# EAGLE design platine_gesamt_V05 (EAGLE 6.4)
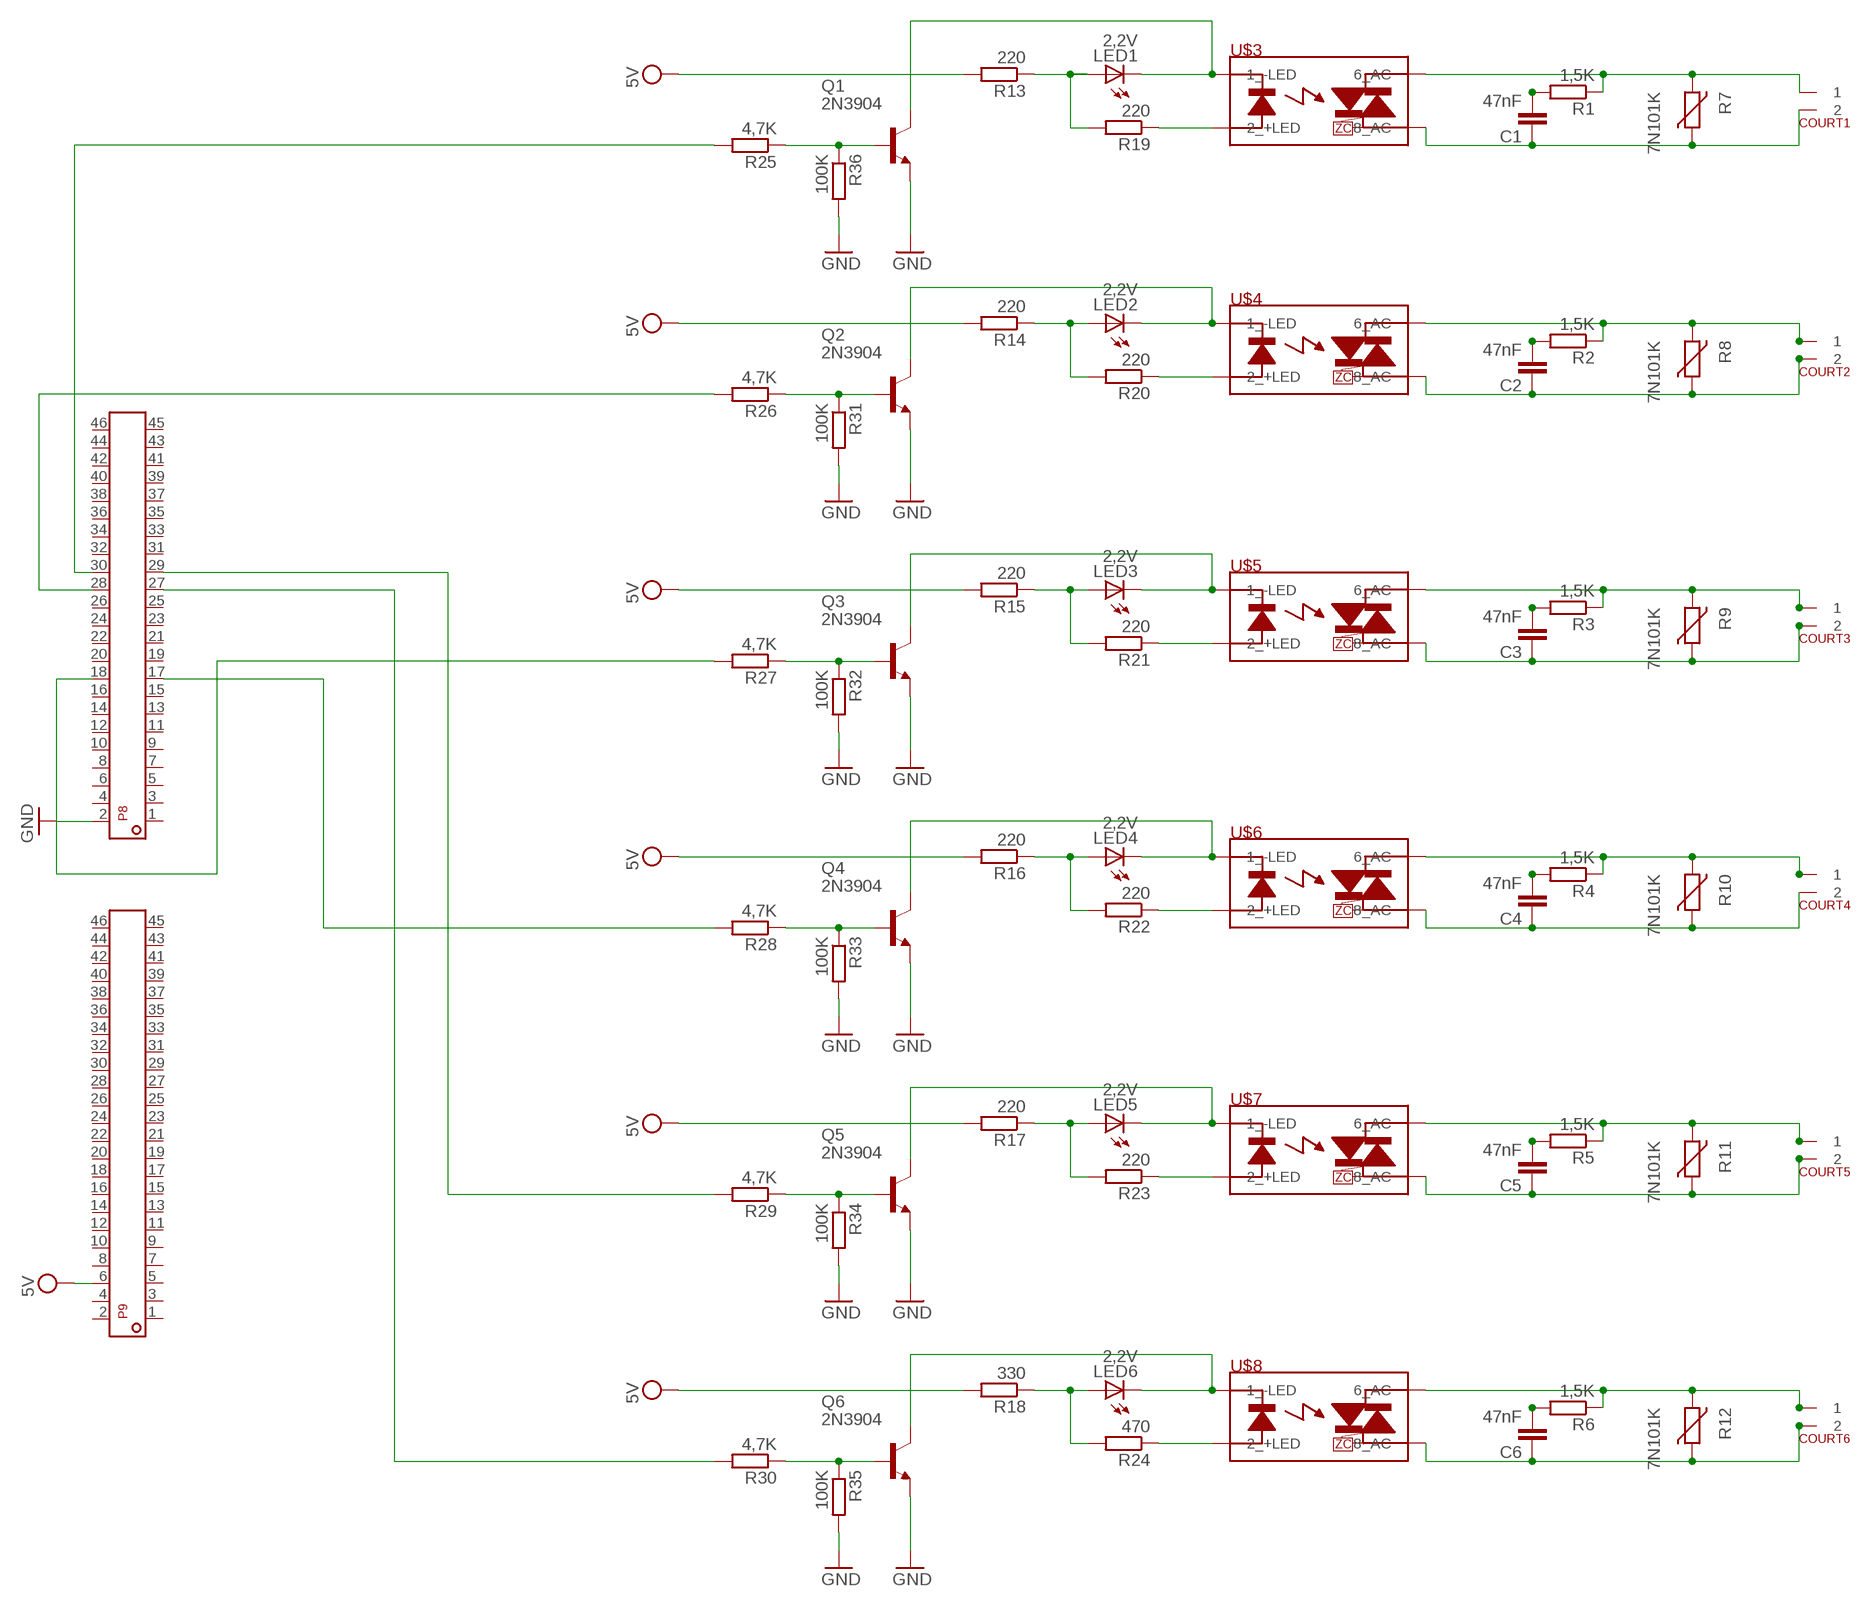
[diagram p0: schematic, sheet 1]

## Parts
C1  47nF  C7.5/3  [C7.5B3]
C2  47nF  C7.5/3  [C7.5B3]
C3  47nF  C7.5/3  [C7.5B3]
C4  47nF  C7.5/3  [C7.5B3]
C5  47nF  C7.5/3  [C7.5B3]
C6  47nF  C7.5/3  [C7.5B3]
COURT1  KLEMMENBLOCK_2POL  [KLEMMENBLOCK_2POL]
COURT2  KLEMMENBLOCK_2POL  [KLEMMENBLOCK_2POL]
COURT3  KLEMMENBLOCK_2POL  [KLEMMENBLOCK_2POL]
COURT4  KLEMMENBLOCK_2POL  [KLEMMENBLOCK_2POL]
COURT5  KLEMMENBLOCK_2POL  [KLEMMENBLOCK_2POL]
COURT6  KLEMMENBLOCK_2POL  [KLEMMENBLOCK_2POL]
LED1  2,2V  LED5MM  [LED5MM]
LED2  2,2V  LED5MM  [LED5MM]
LED3  2,2V  LED5MM  [LED5MM]
LED4  2,2V  LED5MM  [LED5MM]
LED5  2,2V  LED5MM  [LED5MM]
LED6  2,2V  LED5MM  [LED5MM]
P8  FEMALE_HEADER_2X23  [FE23-2W]
P9  FEMALE_HEADER_2X23  [FE23-2W]
Q1  2N3904  [TO92]
Q2  2N3904  [TO92]
Q3  2N3904  [TO92]
Q4  2N3904  [TO92]
Q5  2N3904  [TO92]
Q6  2N3904  [TO92]
R1  1,5K  R-EU_0204/7  [0204/7]
R2  1,5K  R-EU_0204/7  [0204/7]
R3  1,5K  R-EU_0204/7  [0204/7]
R4  1,5K  R-EU_0204/7  [0204/7]
R5  1,5K  R-EU_0204/7  [0204/7]
R6  1,5K  R-EU_0204/7  [0204/7]
R7  7N101K  VARISTOR-5  [R-5]
R8  7N101K  VARISTOR-5  [R-5]
R9  7N101K  VARISTOR-5  [R-5]
R10  7N101K  VARISTOR-5  [R-5]
R11  7N101K  VARISTOR-5  [R-5]
R12  7N101K  VARISTOR-5  [R-5]
R13  220  R-EU_0204/7  [0204/7]
R14  220  R-EU_0204/7  [0204/7]
R15  220  R-EU_0204/7  [0204/7]
R16  220  R-EU_0204/7  [0204/7]
R17  220  R-EU_0204/7  [0204/7]
R18  330  R-EU_0204/7  [0204/7]
R19  220  R-EU_0204/7  [0204/7]
R20  220  R-EU_0204/7  [0204/7]
R21  220  R-EU_0204/7  [0204/7]
R22  220  R-EU_0204/7  [0204/7]
R23  220  R-EU_0204/7  [0204/7]
R24  470  R-EU_0204/7  [0204/7]
R25  4,7K  R-EU_0204/7  [0204/7]
R26  4,7K  R-EU_0204/7  [0204/7]
R27  4,7K  R-EU_0204/7  [0204/7]
R28  4,7K  R-EU_0204/7  [0204/7]
R29  4,7K  R-EU_0204/7  [0204/7]
R30  4,7K  R-EU_0204/7  [0204/7]
R31  100K  R-EU_0204/7  [0204/7]
R32  100K  R-EU_0204/7  [0204/7]
R33  100K  R-EU_0204/7  [0204/7]
R34  100K  R-EU_0204/7  [0204/7]
R35  100K  R-EU_0204/7  [0204/7]
R36  100K  R-EU_0204/7  [0204/7]
U$3  IXYS_PS1201_SSRSIP4/8  [S202S02]
U$4  IXYS_PS1201_SSRSIP4/8  [S202S02]
U$5  IXYS_PS1201_SSRSIP4/8  [S202S02]
U$6  IXYS_PS1201_SSRSIP4/8  [S202S02]
U$7  IXYS_PS1201_SSRSIP4/8  [S202S02]
U$8  IXYS_PS1201_SSRSIP4/8  [S202S02]

## Nets
GND: P8.2 Q1.3(E) Q2.3(E) Q3.3(E) Q4.3(E) Q5.3(E) Q6.3(E) R31.2 R32.2 R33.2 R34.2 R35.2 R36.2
N$1: C1.2 R1.2
N$2: C2.2 R2.2
N$3: C3.2 R3.2
N$4: C4.2 R4.2
N$5: C5.2 R5.2
N$6: C6.2 R6.2
N$7: COURT1.1 R1.1 R7.2 U$3.6(6_AC)
N$8: P8.18 R27.2
N$9: C2.1 COURT2.2 R8.1 U$4.8(8_AC)
N$10: C3.1 COURT3.2 R9.1 U$5.8(8_AC)
N$11: C4.1 COURT4.2 R10.1 U$6.8(8_AC)
N$12: C5.1 COURT5.2 R11.1 U$7.8(8_AC)
N$13: C6.1 COURT6.2 R12.1 U$8.8(8_AC)
N$14: COURT2.1 R2.1 R8.2 U$4.6(6_AC)
N$15: COURT3.1 R3.1 R9.2 U$5.6(6_AC)
N$16: COURT4.1 R4.1 R10.2 U$6.6(6_AC)
N$17: COURT5.1 R5.1 R11.2 U$7.6(6_AC)
N$18: COURT6.1 R6.1 R12.2 U$8.6(6_AC)
N$19: LED1.A R13.1 R19.2
N$20: R19.1 U$3.2(2_+LED)
N$21: LED1.K(C) Q1.1(C) U$3.1(1_-LED)
N$22: Q1.2(B) R25.1 R36.1
N$23: LED2.A R14.1 R20.2
N$24: R20.1 U$4.2(2_+LED)
N$25: LED2.K(C) Q2.1(C) U$4.1(1_-LED)
N$26: Q2.2(B) R26.1 R31.1
N$27: LED3.A R15.1 R21.2
N$28: R21.1 U$5.2(2_+LED)
N$29: LED3.K(C) Q3.1(C) U$5.1(1_-LED)
N$30: Q3.2(B) R27.1 R32.1
N$31: LED4.A R16.1 R22.2
N$32: LED4.K(C) Q4.1(C) U$6.1(1_-LED)
N$33: R22.1 U$6.2(2_+LED)
N$34: Q4.2(B) R28.1 R33.1
N$35: LED5.A R17.1 R23.2
N$36: LED5.K(C) Q5.1(C) U$7.1(1_-LED)
N$37: R23.1 U$7.2(2_+LED)
N$38: Q5.2(B) R29.1 R34.1
N$39: LED6.A R18.1 R24.2
N$40: LED6.K(C) Q6.1(C) U$8.1(1_-LED)
N$41: R24.1 U$8.2(2_+LED)
N$42: Q6.2(B) R30.1 R35.1
N$43: P8.30 R25.2
N$44: P8.28 R26.2
N$46: P8.17 R28.2
N$47: P8.29 R29.2
N$48: P8.27 R30.2
N$49: C1.1 COURT1.2 R7.1 U$3.8(8_AC)
VDD: P9.6 R13.2 R14.2 R15.2 R16.2 R17.2 R18.2 ; supply symbol labelled 5V
Unconnected: P8.1 P8.3 P8.4 P8.5 P8.6 P8.7 P8.8 P8.9 P8.10 P8.11 P8.12 P8.13 P8.14 P8.15 P8.16 P8.19 P8.20 P8.21 P8.22 P8.23 P8.24 P8.25 P8.26 P8.31 P8.32 P8.33 P8.34 P8.35 P8.36 P8.37 P8.38 P8.39 P8.40 P8.41 P8.42 P8.43 P8.44 P8.45 P8.46 P9.1 P9.2 P9.3 P9.4 P9.5 P9.7 P9.8 P9.9 P9.10 P9.11 P9.12 P9.13 P9.14 P9.15 P9.16 P9.17 P9.18 P9.19 P9.20 P9.21 P9.22 P9.23 P9.24 P9.25 P9.26 P9.27 P9.28 P9.29 P9.30 P9.31 P9.32 P9.33 P9.34 P9.35 P9.36 P9.37 P9.38 P9.39 P9.40 P9.41 P9.42 P9.43 P9.44 P9.45 P9.46

## Library data of the parts
C1-C6 = capacitor-wima:C: CAPACITOR naming: grid - package width
COURT1-COURT6 = SPuls:KLEMMENBLOCK_2POL
LED1-LED6 = led:LED: LED OSRAM: - CHIPLED LG R971, LG N971, LY N971, LG Q971, LY Q971, LO R971, LY R971 LH N974, LH R974 LS Q976, LO Q976, LY Q976 LO Q996 - Hyper CHIPLED LW Q18S LB Q993, LB Q99A, LB R99A - SideLED LS A670, LO A670, LY A670, LG A670, LP A670 LB A673, LV A673, LT A673, LW A673 LH A674 LY A675 LS A676, LA A676, LO A676, LY A676, LW A676 LS A679, LY A679, LG A679 - Hyper Micro SIDELED® LS Y876, LA Y876, LO Y876, LY Y876 LT Y87S - SmartLED LW L88C, LW L88S LB L89C, LB L89S, LG L890 LS L89K, LO L89K, LY L89K LS L896, LA L896, LO L896, LY L896 - TOPLED LS T670, LO T670, LY T670, LG T670, LP T670 LSG T670, LSP T670, LSY T670, LOP T670, LYG T670 LG T671, LOG T671, LSG T671 LB T673, LV T673, LT T673, LW T673 LH T674 LS T676, LA T676, LO T676, LY T676, LB T676, LH T676, LSB T676, LW T676 LB T67C, LV T67C, LT T67C, LS T67K, LO T67K, LY T67K, LW E67C LS E67B, LA E67B, LO E67B, LY E67B, LB E67C, LV E67C, LT E67C LW T67C LS T679, LY T679, LG T679 LS T770, LO T770, LY T770, LG T770, LP T770 LB T773, LV T773, LT T773, LW T773 LH T774 LS E675, LA E675, LY E675, LS T675 LS T776, LA T776, LO T776, LY T776, LB T776 LHGB T686 LT T68C, LB T68C - Hyper Mini TOPLED® LB M676 - Mini TOPLED Santana® LG M470 LS M47K, LO M47K, LY M47K Source: http://www.osram.convergy.de LUXEON: - LUMILED® LXK2-PW12-R00, LXK2-PW12-S00, LXK2-PW14-U00, LXK2-PW14-V00 LXK2-PM12-R00, LXK2-PM12-S00, LXK2-PM14-U00 LXK2-PE12-Q00, LXK2-PE12-R00, LXK2-PE12-S00, LXK2-PE14-T00, LXK2-PE14-U00 LXK2-PB12-K00, LXK2-PB12-L00, LXK2-PB12-M00, LXK2-PB14-N00, LXK2-PB14-P00, LXK2-PB14-Q00 LXK2-PR12-L00, LXK2-PR12-M00, LXK2-PR14-Q00, LXK2-PR14-R00 LXK2-PD12-Q00, LXK2-PD12-R00, LXK2-PD12-S00 LXK2-PH12-R00, LXK2-PH12-S00 LXK2-PL12-P00, LXK2-PL12-Q00, LXK2-PL12-R00 Source: www.luxeon.com KINGBRIGHT: KA-3528ASYC Source: www.kingbright.com
P8 P9 = SPuls:FEMALE_HEADER_2X23
Q1-Q6 = transistor-npn:2N3904: NPN Transistor
R1-R6 R13-R36 = rcl:R-EU_: RESISTOR, European symbol
R7-R12 = varistor:VARISTOR: VARISTOR
U$3-U$8 = SPuls:IXYS_PS1201_SSR

## Board
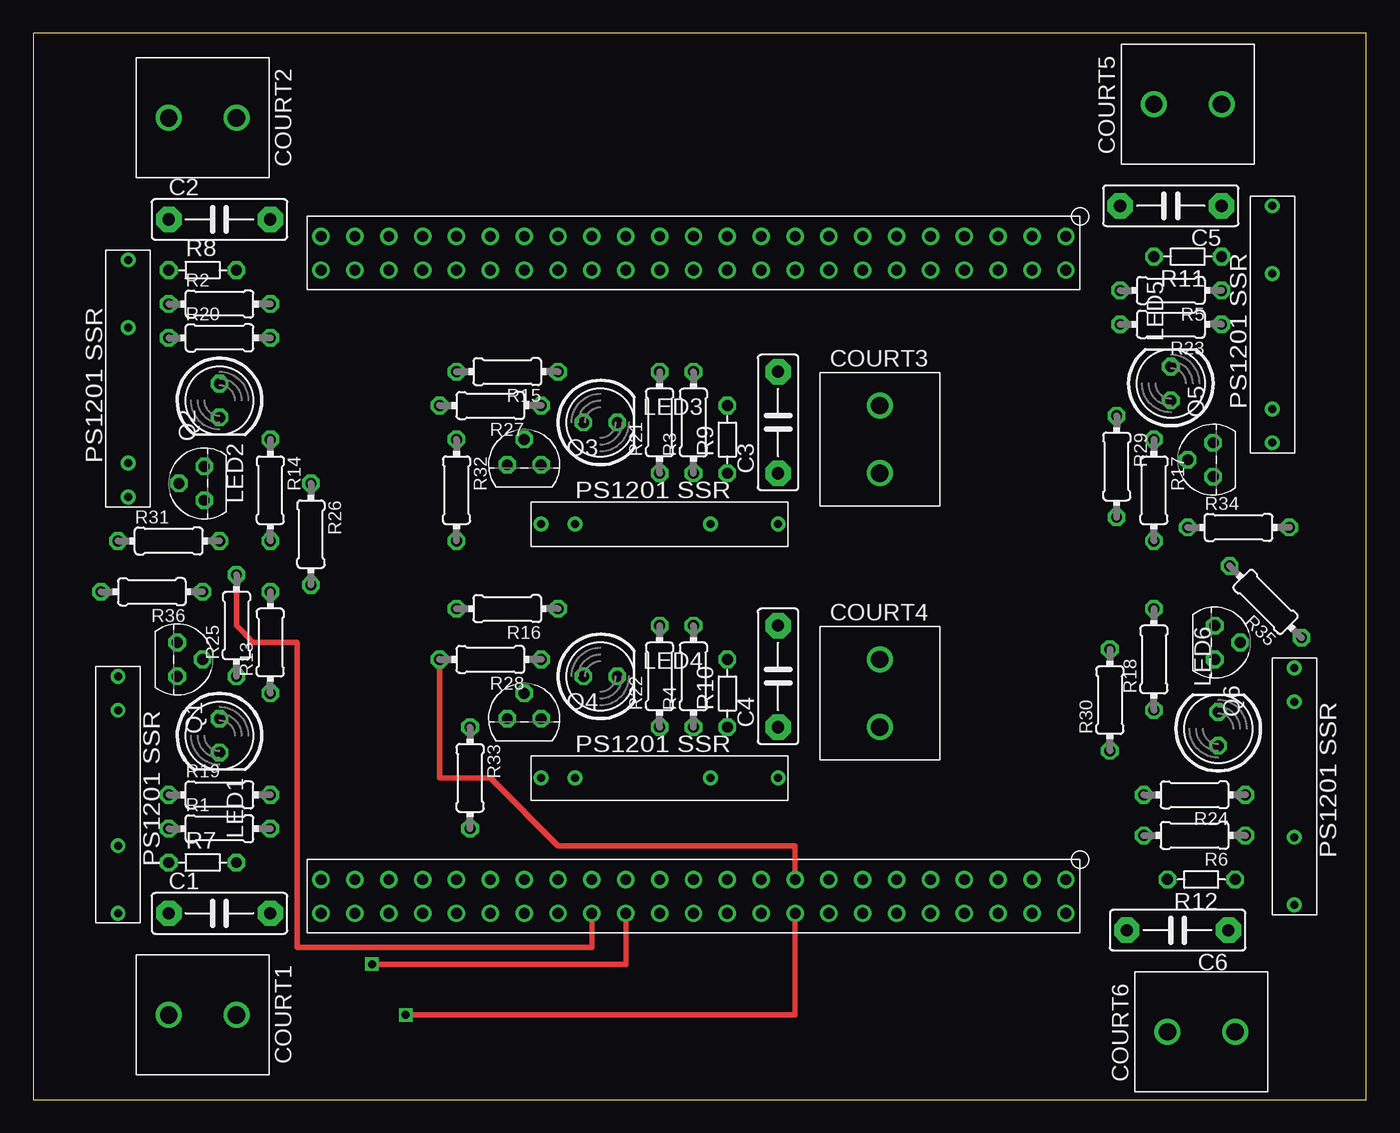
[diagram p1: board, top side]
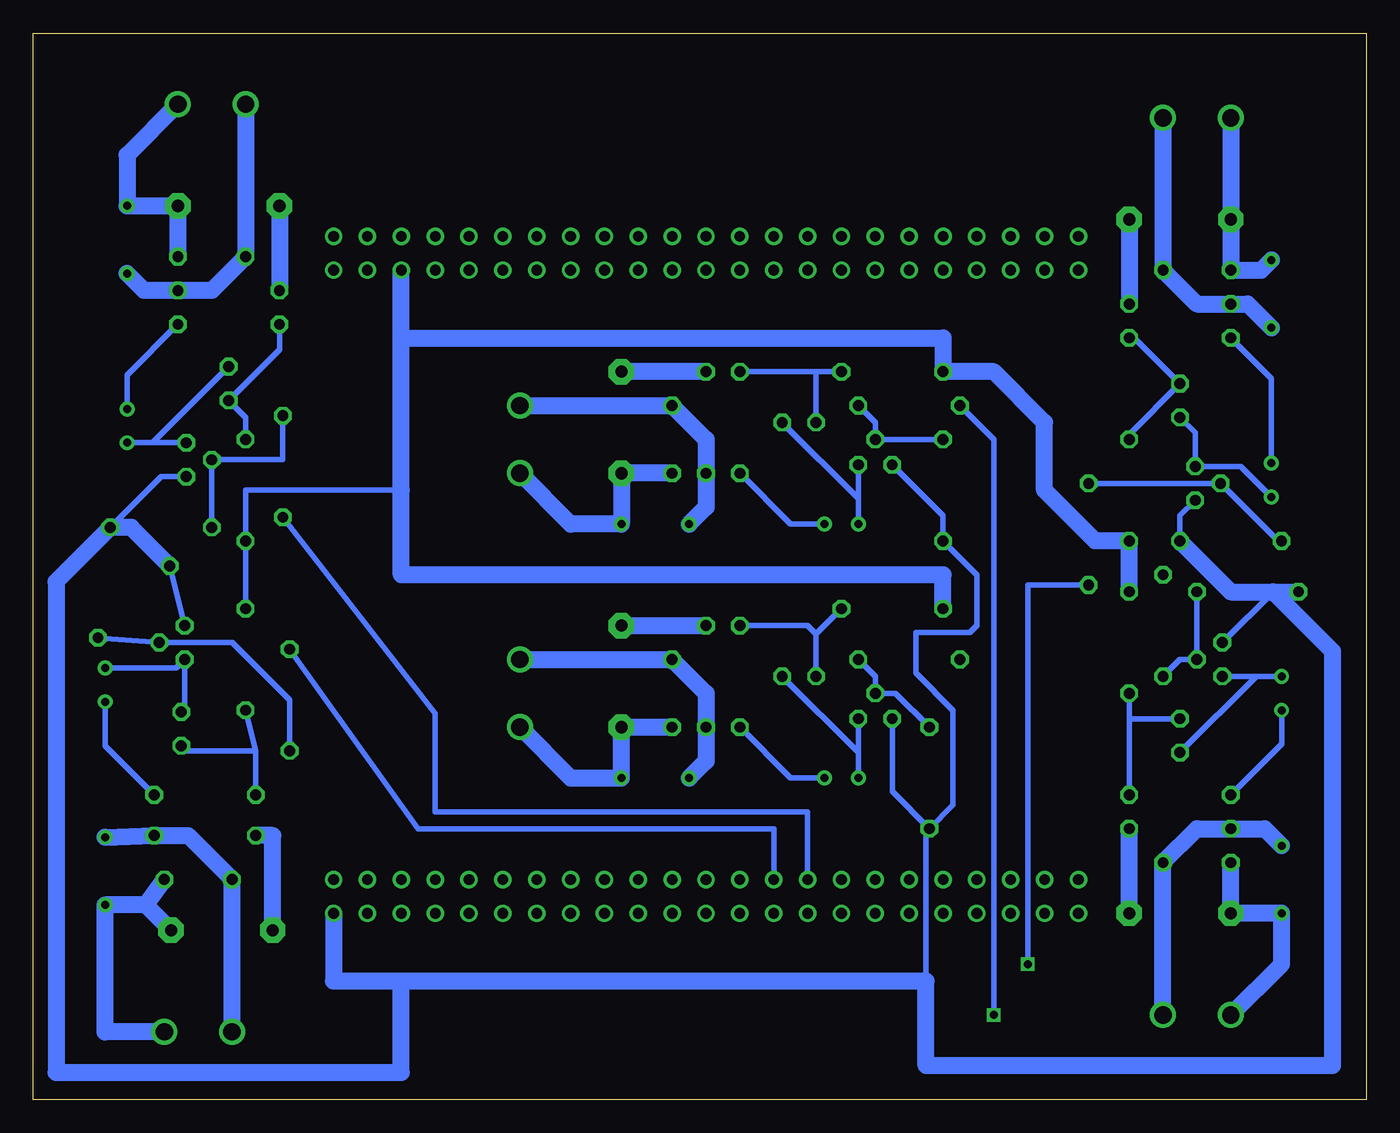
[diagram p2: board, bottom side, seen from below]

Size 100 x 80 mm. Coordinates in mm from the lower left corner, seen from the top.
Outline: 0,0 100,0 100,80 0,80 0,0
Copper layers (1*16): Top 0.035mm / dielectric 1.5mm / Bottom 0.035mm
Design rules "default": minimum track width 10mil, minimum drill 24mil, track to track 8mil, track to pad 8mil, pad to pad 8mil, via to via 8mil, smd to smd 8mil, copper to edge 40mil, drill to drill 8mil, minimum pad ring 10mil, minimum via ring 8mil, stop-mask expansion 4mil, vias tented up to drill 0mil, thermal gap 10mil

### Footprints (pad centres in the part's own frame; a part is rotated, then mirrored left to right if it is on the bottom)
C7.5B3 = drill 0.914 pad 1.905 octagon: 1 -3.81,0; 2 3.81,0
KLEMMENBLOCK_2POL = drill 1.3: 1 -2.54,0; 2 2.54,0
LED5MM = drill 0.813 octagon: A -1.27,0; K 1.27,0
FE23-2W = drill 0.8: 1 -27.94,0; 2 -27.94,2.54; 3 -25.4,0; 4 -25.4,2.54; 5 -22.86,0; 6 -22.86,2.54; 7 -20.32,0; 8 -20.32,2.54; 9 -17.78,0; 10 -17.78,2.54; 11 -15.24,0; 12 -15.24,2.54; 13 -12.7,0; 14 -12.7,2.54; 15 -10.16,0; 16 -10.16,2.54; 17 -7.62,0; 18 -7.62,2.54; 19 -5.08,0; 20 -5.08,2.54; 21 -2.54,0; 22 -2.54,2.54; 23 0,0; 24 0,2.54; 25 2.54,0; 26 2.54,2.54; 27 5.08,0; 28 5.08,2.54; 29 7.62,0; 30 7.62,2.54; 31 10.16,0; 32 10.16,2.54; 33 12.7,0; 34 12.7,2.54; 35 15.24,0; 36 15.24,2.54; 37 17.78,0; 38 17.78,2.54; 39 20.32,0; 40 20.32,2.54; 41 22.86,0; 42 22.86,2.54; 43 25.4,0; 44 25.4,2.54; 45 27.94,0; 46 27.94,2.54
TO92 = drill 0.813 octagon: 1 1.27,0; 2 0,1.905; 3 -1.27,0
0204/7 = drill 0.813 octagon: 1 -3.81,0; 2 3.81,0
R-5 = drill 0.813 octagon: 1 -2.54,0; 2 2.54,0
S202S02 = drill 0.6: 1 -7.62,0; 2 -5.08,0; 6 5.08,0; 8 10.16,0

### Placement (x,y rotation side)
C1  13.97,13.97 0 top
C2  13.97,66.04 0 top
C3  55.88,50.8 90 top
C4  55.88,31.75 90 top
C5  85.34,67.06 180 top
C6  85.85,12.7 180 top
COURT1  12.7,6.35 180 top
COURT2  12.7,73.66 180 top
COURT3  63.5,49.53 270 top
COURT4  63.5,30.48 270 top
COURT5  86.61,74.68 0 top
COURT6  87.63,5.08 0 top
LED1  13.97,27.3 270 top
LED2  13.97,52.45 270 top
LED3  42.55,50.8 0 top
LED4  42.55,31.75 0 top
LED5  85.34,53.72 90 top
LED6  88.9,27.81 90 top
P8  49.53,16.51 180 top
P9  49.53,64.77 180 top
Q1  10.79,33.02 270 top
Q2  12.83,46.23 90 top
Q3  36.83,47.62 0 top
Q4  36.83,28.57 0 top
Q5  88.52,48.01 90 top
Q6  88.65,34.29 270 top
R1  13.97,20.32 0 top
R2  13.97,59.69 0 top
R3  49.53,50.8 90 top
R4  49.53,31.75 90 top
R5  85.34,60.71 180 top
R6  87.12,19.81 180 top
R7  12.7,17.78 0 top
R8  12.7,62.23 0 top
R9  52.07,49.53 90 top
R10  52.07,30.48 90 top
R11  86.61,63.25 180 top
R12  87.63,16.51 180 top
R13  17.78,34.29 90 top
R14  17.78,45.72 270 top
R15  35.56,54.61 180 top
R16  35.56,36.83 180 top
R17  84.07,45.72 270 top
R18  84.07,33.02 90 top
R19  13.97,22.86 0 top
R20  13.97,57.15 0 top
R21  46.99,50.8 90 top
R22  46.99,31.75 90 top
R23  85.34,58.17 180 top
R24  87.12,22.86 180 top
R25  15.24,35.56 90 top
R26  20.83,42.42 270 top
R27  34.29,52.07 180 top
R28  34.29,33.02 180 top
R29  81.28,47.5 270 top
R30  80.77,29.97 90 top
R31  10.16,41.91 0 top
R32  31.75,45.72 270 top
R33  32.77,24.13 270 top
R34  90.42,42.93 0 top
R35  92.46,37.34 135 top
R36  8.89,38.1 180 top
U$3  6.35,24.13 270 top
U$4  7.11,52.83 90 top
U$5  45.72,43.18 0 top
U$6  45.72,24.13 0 top
U$7  92.96,56.9 90 top
U$8  94.61,24.77 270 top

### Tracks (layer width: path | path; a pad name or v marks a point on that pad's centre or on a via)
GND
  Bottom 0.406: R36.2 6.99,38.1 Q1.3 | Q3.3 31.75,43.81 R32.2 29.21,39.37 29.21,35.56 29.72,35.05 33.78,35.05 33.78,32 30.99,29.21 30.99,22.1 R33.2 | R34.2 90.42,46.74 Q5.3 | Q6.3 R35.2 | R31.2 13.97,43.81 Q2.3 | R33.2 35.56,23.11 Q4.3 | R33.2 33.02,20.07 33.02,8.89
  Bottom 1.27: 72.39,8.89 33.02,8.89 33.02,2.54 2.54,2.54 2.54,33.66 6.99,38.1 | R31.2 10.16,38.1 R36.2 | 72.39,8.89 72.39,2.03 98.3,2.03 98.3,38.86 R34.2 92.66,42.93 R35.2 | P8.2 77.47,8.89 72.39,8.89
N$1
  Bottom 1.27: C1.2 R1.2
N$2
  Bottom 1.27: C2.2 R2.2
N$3
  Bottom 1.27: R3.2 C3.2
N$4
  Bottom 1.27: C4.2 R4.2
N$5
  Bottom 1.27: C5.2 R5.2
N$6
  Bottom 1.27: C6.2 82.04,19.81 R6.2
N$7
  Bottom 1.27: COURT1.1 R7.2 12.7,20.32 R1.1 7.62,20.32 U$3.6
N$8  (via drill 0.6)
  Top 0.406: v27.94,6.35 57.15,6.35 P8.18
  Bottom 0.406: R27.2 27.94,49.53 v27.94,6.35
N$9
  Bottom 1.27: COURT2.2 C2.1 R8.1 7.87,62.23 U$4.8
N$10
  Bottom 1.27: R9.1 C3.1 U$5.8 59.69,43.18 COURT3.2
N$11
  Bottom 1.27: R10.1 C4.1 U$6.8 59.69,24.13 COURT4.2
N$12
  Bottom 1.27: COURT5.2 92.96,70.87 U$7.8 C5.1 R11.1
N$13
  Bottom 1.27: COURT6.2 94.61,5.08 U$8.8 91.57,14.61 | C6.1 91.57,14.61 | R12.1 91.57,14.61
N$14
  Bottom 1.27: COURT2.1 R8.2 12.7,59.69 R2.1 8.89,59.69 U$4.6
N$15
  Bottom 1.27: COURT3.1 R9.2 49.53,49.53 R3.1 49.53,44.45 U$5.6
N$16
  Bottom 1.27: COURT4.1 R10.2 49.53,30.48 R4.1 49.53,25.4 U$6.6
N$17
  Bottom 1.27: COURT5.1 R11.2 86.61,60.71 R5.1 91.69,60.71 U$7.6
N$18
  Bottom 1.27: COURT6.1 R12.2 88.39,19.81 R6.1 U$8.6
N$19
  Bottom 0.406: LED1.A 17.78,28.57 | 17.78,28.57 R19.2 | R13.1 17.78,28.57
N$20
  Bottom 0.406: U$3.2 6.35,26.67 R19.1
N$21
  Bottom 0.406: U$3.1 8.26,31.75 | 8.26,31.75 LED1.K | Q1.1 8.26,31.75
N$22
  Bottom 0.406: R36.1 Q1.2 13.97,33.02 R25.1
N$23
  Bottom 0.406: R20.2 17.4,57.15 LED2.A 17.78,49.91 R14.1
N$24
  Bottom 0.406: U$4.2 7.11,54.1 R20.1
N$25
  Bottom 0.406: LED2.K 12.83,50.04 Q2.1 9.4,47.5 U$4.1
N$26
  Bottom 0.406: R31.1 6.6,41.91 Q2.2 R26.1
N$27
  Bottom 0.406: R21.2 R15.1 41.27,54.61 LED3.A
N$28
  Bottom 0.406: R21.1 43.18,43.18 U$5.2
N$29
  Bottom 0.406: U$5.1 38.1,45.09 | 38.1,45.09 LED3.K | Q3.1 38.1,45.09
N$30
  Bottom 0.406: R27.1 36.83,50.8 Q3.2 R32.1
N$31
  Bottom 0.406: LED4.A 41.27,34.92 | 41.27,34.92 R16.1 | R22.2 41.91,35.56 41.27,34.92
N$32
  Bottom 0.406: U$6.1 38.1,26.04 | 38.1,26.04 LED4.K | Q4.1 38.1,26.04
N$33
  Bottom 0.406: R22.1 43.18,24.13 U$6.2
N$34
  Bottom 0.406: R28.1 36.83,31.75 Q4.2 35.31,30.48 R33.1
N$35
  Bottom 0.406: R17.1 84.07,51.18 LED5.A 81.53,56.26 R23.2
N$36
  Bottom 0.406: U$7.1 91.06,49.28 | 91.06,49.28 LED5.K | Q5.1 91.06,49.28
N$37
  Bottom 0.406: R23.1 92.96,54.36 U$7.2
N$38
  Bottom 0.406: R34.1 Q5.2 81.28,48.01 R29.1
N$39
  Bottom 0.406: R24.2 83.31,26.16 | 83.31,26.16 R18.1 | LED6.A 88.52,26.16 83.31,26.16
N$40
  Bottom 0.406: LED6.K 88.65,29.34 Q6.1 89.28,32.38 U$8.1
N$41
  Bottom 0.406: R24.1 94.61,26.54 U$8.2
N$42
  Bottom 0.406: R30.1 80.77,29.97 85.09,34.29 Q6.2 R35.1
N$43
  Top 0.406: R25.2 15.24,35.56 16.51,34.29 19.81,34.29 19.81,11.43 41.91,11.43 P8.30
N$44  (via drill 0.6)
  Top 0.406: v25.4,10.16 44.45,10.16 P8.28
  Bottom 0.406: R26.2 25.4,38.61 v25.4,10.16
N$46
  Top 0.406: R28.2 30.48,24.13 34.29,24.13 39.37,19.05 57.15,19.05 P8.17
N$47
  Bottom 0.406: P8.29 41.91,21.59 69.85,21.59 69.85,28.96 R29.2
N$48
  Bottom 0.406: P8.27 44.45,20.32 71.12,20.32 R30.2
N$49
  Bottom 1.27: COURT1.2 6.35,10.16 U$3.8 C1.1 R7.1
VDD
  Bottom 0.406: R18.2 R17.2 84.07,45.72 72.39,45.72 | P9.6 72.39,57.15
  Bottom 1.27: R13.2 R14.2 20.32,41.91 24.13,45.72 24.13,50.8 27.94,54.61 R15.2 31.75,57.15 72.39,57.15 | P9.6 72.39,45.72 72.39,39.37 31.75,39.37 R16.2